# Altium schematic sheet P08 DDR3.SchDoc
size 420 x 297 mm
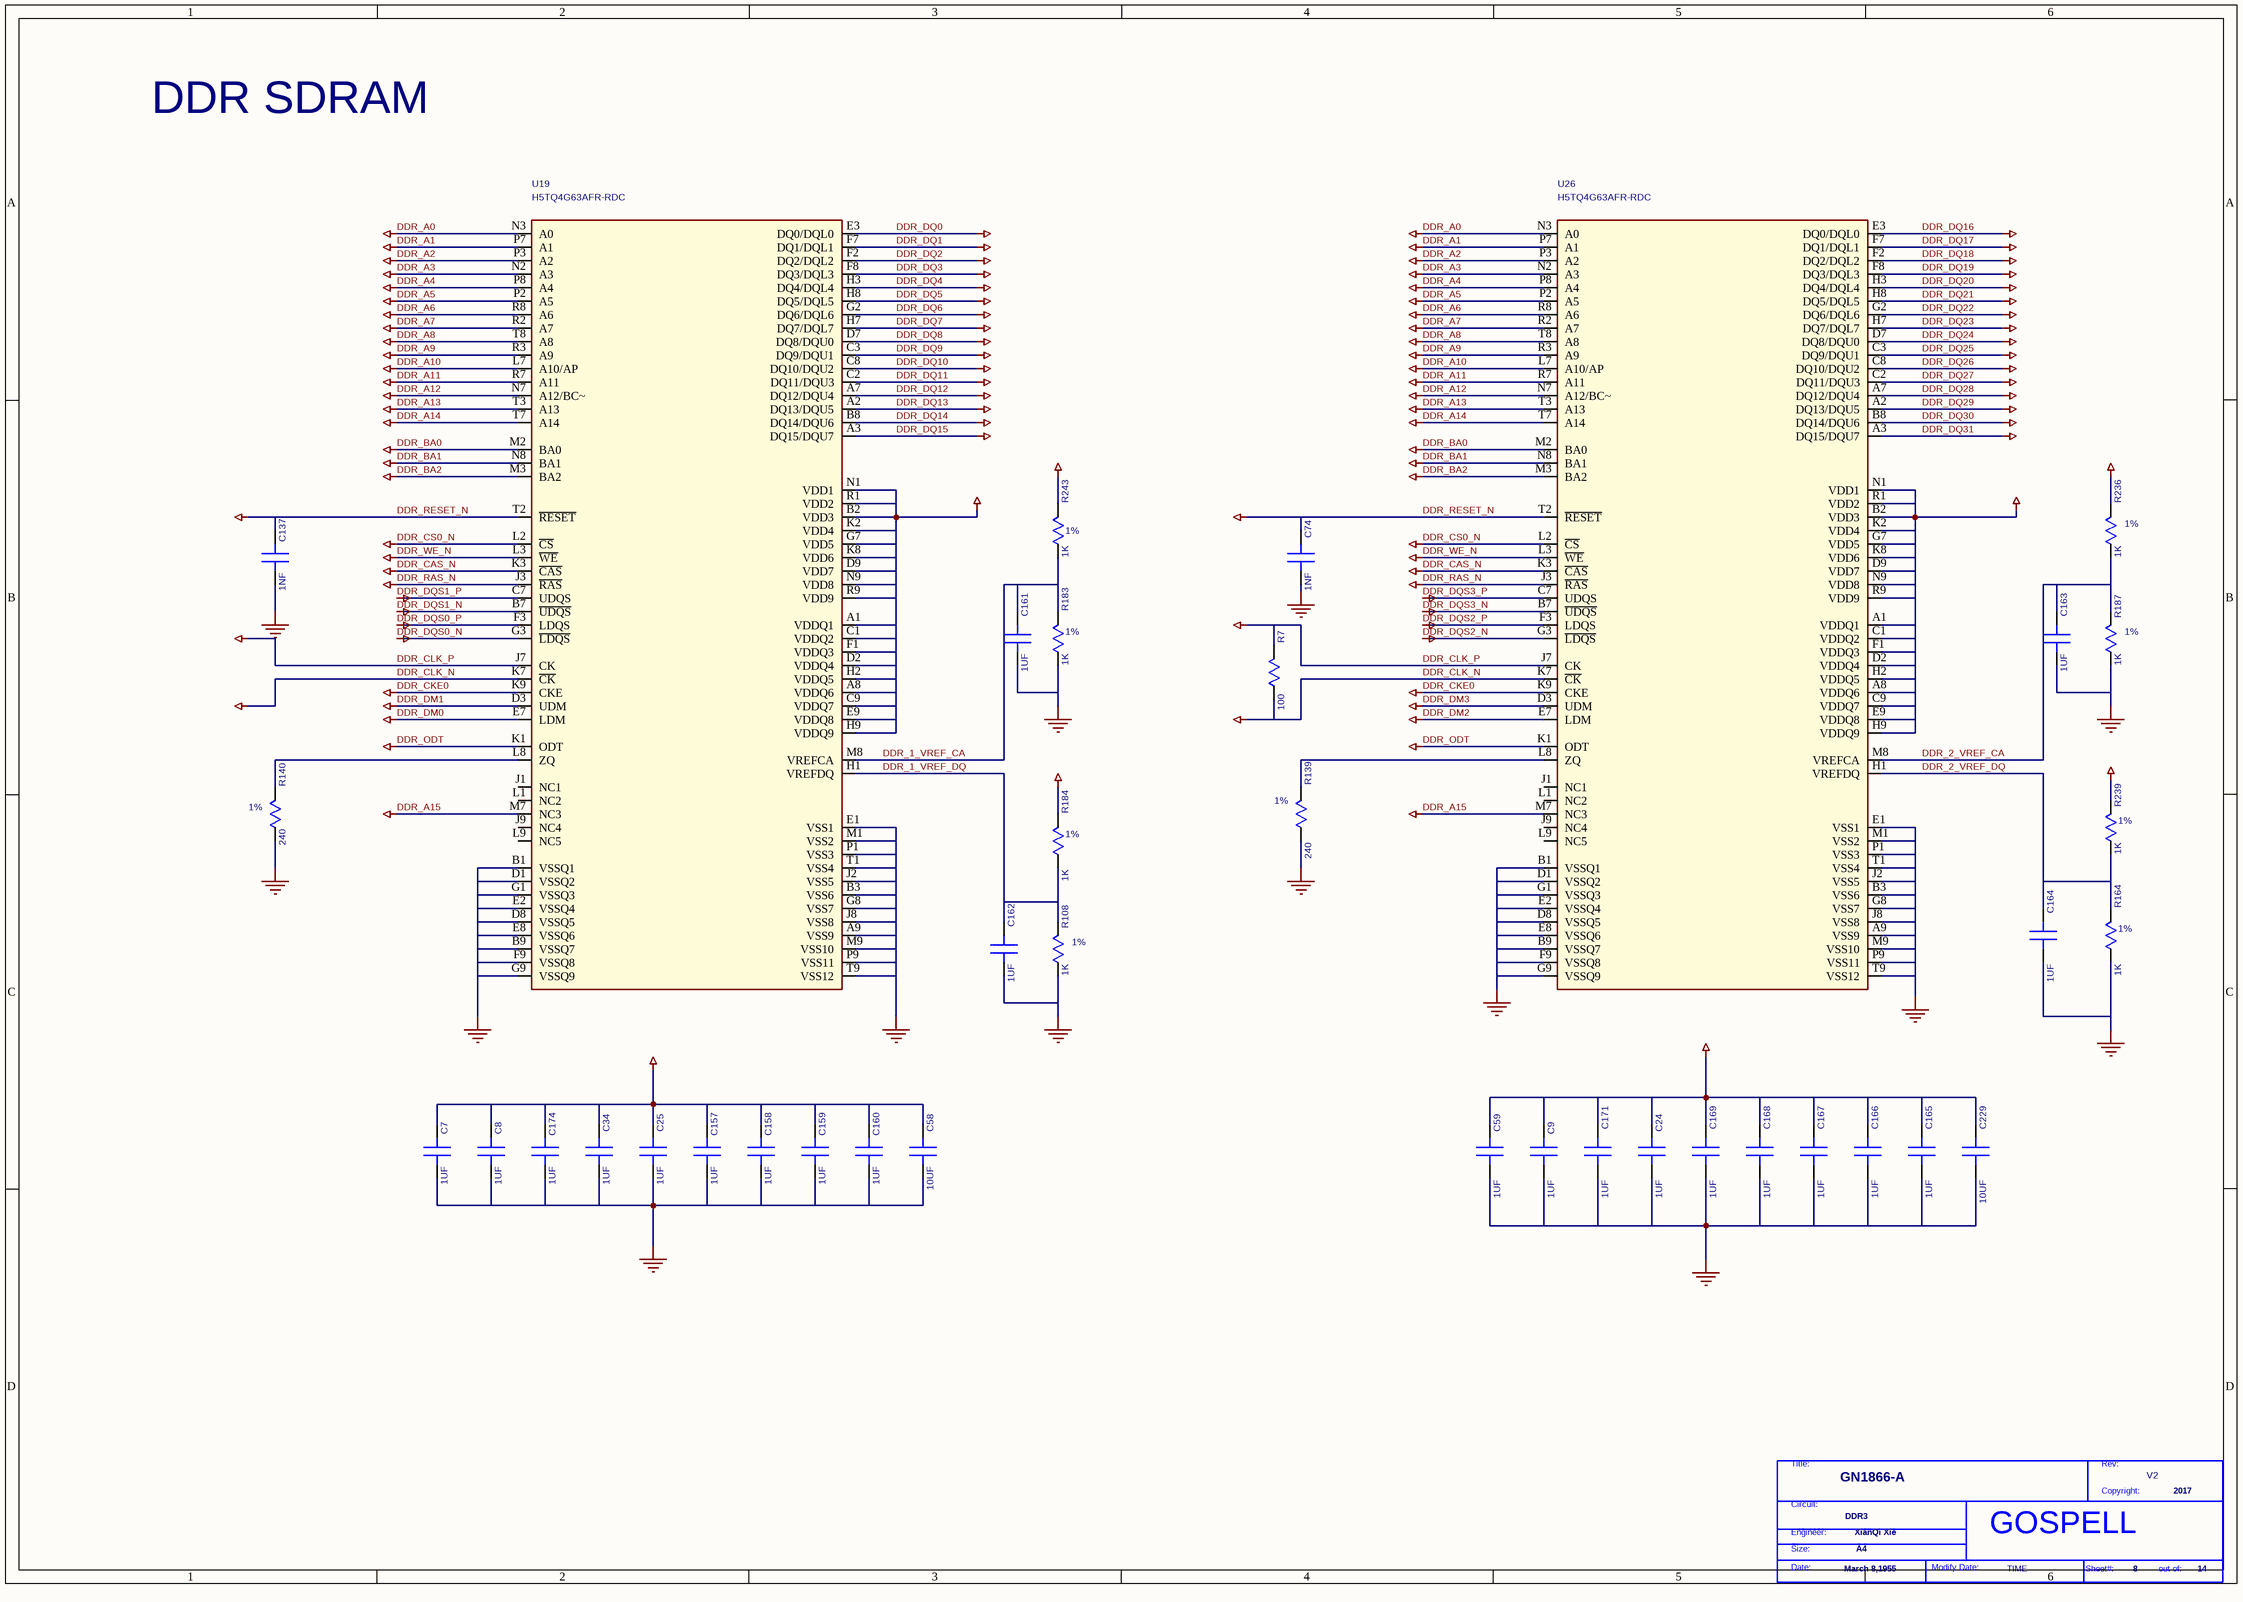
[diagram p0: P08 DDR3.SchDoc]

## Parts
*  Page Modify Date: TIME  Engineer: XianQi Xie  Copyright: 2017  Title: GN1866-A  RevCode: V2  Page Size: A4  Page Create Date: March 8,1955  Page Number: 8  Page Count: 14  Doc: DDR3  (hidden comment: GOSPELL)  (graphical)
C7  1UF  [SC0402]
C8  1UF  [SC0402]
C9  1UF  [SC0402]
C24  1UF  [SC0402]
C25  1UF  [SC0402]
C34  1UF  [SC0402]
C58  10UF  [SC0603]
C59  1UF  [SC0402]
C74  1NF  [SC0402]
C137  1NF  [SC0402]
C157  1UF  [SC0402]
C158  1UF  [SC0402]
C159  1UF  [SC0402]
C160  1UF  [SC0402]
C161  1UF  [SC0402]
C162  1UF  [SC0402]
C163  1UF  [SC0402]
C164  1UF  [SC0402]
C165  1UF  [SC0402]
C166  1UF  [SC0402]
C167  1UF  [SC0402]
C168  1UF  [SC0402]
C169  1UF  [SC0402]
C171  1UF  [SC0402]
C174  1UF  [SC0402]
C229  10UF  [SC0603]
R7  100  [SR0402]
R108  1K  [SR0402]
R139  240  [SR0402]
R140  240  [SR0402]
R164  1K  [SR0402]
R183  1K  [SR0402]
R184  1K  [SR0402]
R187  1K  [SR0402]
R236  1K  [SR0402]
R239  1K  [SR0402]
R243  1K  [SR0402]
U19  DEVICE: H5TQ4G63AFR-RDC  [BGA96-32-1609G]  (hidden comment: NT5CC256M16CP)
U26  DEVICE: H5TQ4G63AFR-RDC  [BGA96-32-1609G]  (hidden comment: NT5CC256M16CP)

## Nets
1V35/1V5: C7.1(A) C8.1(A) C9.1(A) C24.1(A) C25.1(A) C34.1(A) C58.1(A) C59.1(A) C157.1(A) C158.1(A) C159.1(A) C160.1(A) C165.1(A) C166.1(A) C167.1(A) C168.1(A) C169.1(A) C171.1(A) C174.1(A) C229.1(A) R184.2(B) R236.2(B) R239.2(B) R243.2(B) U19.A1(VDDQ1) U19.A8(VDDQ6) U19.B2(VDD3) U19.C1(VDDQ2) U19.C9(VDDQ7) U19.D2(VDDQ4) U19.D9(VDD7) U19.E9(VDDQ8) U19.F1(VDDQ3) U19.G7(VDD5) U19.H2(VDDQ5) U19.H9(VDDQ9) U19.K2(VDD4) U19.K8(VDD6) U19.N1(VDD1) U19.N9(VDD8) U19.R1(VDD2) U19.R9(VDD9) U26.A1(VDDQ1) U26.A8(VDDQ6) U26.B2(VDD3) U26.C1(VDDQ2) U26.C9(VDDQ7) U26.D2(VDDQ4) U26.D9(VDD7) U26.E9(VDDQ8) U26.F1(VDDQ3) U26.G7(VDD5) U26.H2(VDDQ5) U26.H9(VDDQ9) U26.K2(VDD4) U26.K8(VDD6) U26.N1(VDD1) U26.N9(VDD8) U26.R1(VDD2) U26.R9(VDD9)
DDR_A0: U19.N3(A0) U26.N3(A0)
DDR_A1: U19.P7(A1) U26.P7(A1)
DDR_A2: U19.P3(A2) U26.P3(A2)
DDR_A3: U19.N2(A3) U26.N2(A3)
DDR_A4: U19.P8(A4) U26.P8(A4)
DDR_A5: U19.P2(A5) U26.P2(A5)
DDR_A6: U19.R8(A6) U26.R8(A6)
DDR_A7: U19.R2(A7) U26.R2(A7)
DDR_A8: U19.T8(A8) U26.T8(A8)
DDR_A9: U19.R3(A9) U26.R3(A9)
DDR_A10: U19.L7(A10/AP) U26.L7(A10/AP)
DDR_A11: U19.R7(A11) U26.R7(A11)
DDR_A12: U19.N7(A12/BC~) U26.N7(A12/BC~)
DDR_A13: U19.T3(A13) U26.T3(A13)
DDR_A14: U19.T7(A14) U26.T7(A14)
DDR_A15: U19.M7(NC3) U26.M7(NC3)
DDR_BA0: U19.M2(BA0) U26.M2(BA0)
DDR_BA1: U19.N8(BA1) U26.N8(BA1)
DDR_BA2: U19.M3(BA2) U26.M3(BA2)
DDR_CAS_N: U19.K3(~{CAS}) U26.K3(~{CAS})
DDR_CKE0: U19.K9(CKE) U26.K9(CKE)
DDR_CLK_N: R7.1(A) U19.K7(~{CK}) U26.K7(~{CK})
DDR_CLK_P: R7.2(B) U19.J7(CK) U26.J7(CK)
DDR_CS0_N: U19.L2(~{CS}) U26.L2(~{CS})
DDR_DM0: U19.E7(LDM)
DDR_DM1: U19.D3(UDM)
DDR_DM2: U26.E7(LDM)
DDR_DM3: U26.D3(UDM)
DDR_DQ0: U19.E3(DQ0/DQL0)
DDR_DQ1: U19.F7(DQ1/DQL1)
DDR_DQ2: U19.F2(DQ2/DQL2)
DDR_DQ3: U19.F8(DQ3/DQL3)
DDR_DQ4: U19.H3(DQ4/DQL4)
DDR_DQ5: U19.H8(DQ5/DQL5)
DDR_DQ6: U19.G2(DQ6/DQL6)
DDR_DQ7: U19.H7(DQ7/DQL7)
DDR_DQ8: U19.D7(DQ8/DQU0)
DDR_DQ9: U19.C3(DQ9/DQU1)
DDR_DQ10: U19.C8(DQ10/DQU2)
DDR_DQ11: U19.C2(DQ11/DQU3)
DDR_DQ12: U19.A7(DQ12/DQU4)
DDR_DQ13: U19.A2(DQ13/DQU5)
DDR_DQ14: U19.B8(DQ14/DQU6)
DDR_DQ15: U19.A3(DQ15/DQU7)
DDR_DQ16: U26.E3(DQ0/DQL0)
DDR_DQ17: U26.F7(DQ1/DQL1)
DDR_DQ18: U26.F2(DQ2/DQL2)
DDR_DQ19: U26.F8(DQ3/DQL3)
DDR_DQ20: U26.H3(DQ4/DQL4)
DDR_DQ21: U26.H8(DQ5/DQL5)
DDR_DQ22: U26.G2(DQ6/DQL6)
DDR_DQ23: U26.H7(DQ7/DQL7)
DDR_DQ24: U26.D7(DQ8/DQU0)
DDR_DQ25: U26.C3(DQ9/DQU1)
DDR_DQ26: U26.C8(DQ10/DQU2)
DDR_DQ27: U26.C2(DQ11/DQU3)
DDR_DQ28: U26.A7(DQ12/DQU4)
DDR_DQ29: U26.A2(DQ13/DQU5)
DDR_DQ30: U26.B8(DQ14/DQU6)
DDR_DQ31: U26.A3(DQ15/DQU7)
DDR_DQS0_N: U19.G3(~{LDQS})
DDR_DQS0_P: U19.F3(LDQS)
DDR_DQS1_N: U19.B7(~{UDQS})
DDR_DQS1_P: U19.C7(UDQS)
DDR_DQS2_N: U26.G3(~{LDQS})
DDR_DQS2_P: U26.F3(LDQS)
DDR_DQS3_N: U26.B7(~{UDQS})
DDR_DQS3_P: U26.C7(UDQS)
DDR_ODT: U19.K1(ODT) U26.K1(ODT)
DDR_RAS_N: U19.J3(~{RAS}) U26.J3(~{RAS})
DDR_RESET_N: C74.1(A) C137.1(A) U19.T2(~{RESET}) U26.T2(~{RESET})
DDR_WE_N: U19.L3(~{WE}) U26.L3(~{WE})
GND: C7.2(B) C8.2(B) C9.2(B) C24.2(B) C25.2(B) C34.2(B) C58.2(B) C59.2(B) C74.2(B) C137.2(B) C157.2(B) C158.2(B) C159.2(B) C160.2(B) C161.2(B) C162.2(B) C163.2(B) C164.2(B) C165.2(B) C166.2(B) C167.2(B) C168.2(B) C169.2(B) C171.2(B) C174.2(B) C229.2(B) R108.1(A) R139.1(A) R140.1(A) R164.1(A) R183.1(A) R187.1(A) U19.A9(VSS9) U19.B1(VSSQ1) U19.B3(VSS6) U19.B9(VSSQ7) U19.D1(VSSQ2) U19.D8(VSSQ5) U19.E1(VSS1) U19.E2(VSSQ4) U19.E8(VSSQ6) U19.F9(VSSQ8) U19.G1(VSSQ3) U19.G8(VSS7) U19.G9(VSSQ9) U19.J2(VSS5) U19.J8(VSS8) U19.M1(VSS2) U19.M9(VSS10) U19.P1(VSS3) U19.P9(VSS11) U19.T1(VSS4) U19.T9(VSS12) U26.A9(VSS9) U26.B1(VSSQ1) U26.B3(VSS6) U26.B9(VSSQ7) U26.D1(VSSQ2) U26.D8(VSSQ5) U26.E1(VSS1) U26.E2(VSSQ4) U26.E8(VSSQ6) U26.F9(VSSQ8) U26.G1(VSSQ3) U26.G8(VSS7) U26.G9(VSSQ9) U26.J2(VSS5) U26.J8(VSS8) U26.M1(VSS2) U26.M9(VSS10) U26.P1(VSS3) U26.P9(VSS11) U26.T1(VSS4) U26.T9(VSS12)
DDR_1_VREF_CA: C161.1(A) R183.2(B) R243.1(A) U19.M8(VREFCA)
DDR_1_VREF_DQ: C162.1(A) R108.2(B) R184.1(A) U19.H1(VREFDQ)
DDR_2_VREF_CA: C163.1(A) R187.2(B) R236.1(A) U26.M8(VREFCA)
DDR_2_VREF_DQ: C164.1(A) R164.2(B) R239.1(A) U26.H1(VREFDQ)
NetR139_2: R139.2(B) U26.L8(ZQ)
NetR140_2: R140.2(B) U19.L8(ZQ)

Not connected (* = marked no-connect by the designer): U19 J1(NC1) J9(NC4) L1(NC2) L9(NC5); U26 J1(NC1) J9(NC4) L1(NC2) L9(NC5)

## Notes on the sheet
- DDR SDRAM
- (near R243) 1%
- (near R236) 1%
- (near R183) 1%
- (near R187) 1%
- (near R139) 1%
- (near R140) 1%
- (near R184) 1%
- (near R239) 1%
- (near R164) 1%
- (near R108) 1%
- (in symbol GOSPELL) Title:; Rev:; Copyright:; Circuit:; Engineer:; Size:; Date:; Modify Date:; Sheet#:; out of:

## Library data of the parts
C7-C9 C25 C59 C158 C160-C162 C165 C167 C169 C171 = C_0_Dup2: PARTS: 1; OriginalSymbolOrigin: (0,30); DEVICE: CV05X5R105K10AH; LEVEL: STD; PINSWAP: (A,B); GVALUE: C  10V  1uF +80%~-20%  X5R 0402; CODE: 8070612; %195%%232%%202%%246%: SMD陶瓷电容-10V-1000NF-+/-10%-X5R-0402-BT,TS16949; %182%%238%%182%%168%%185%%164%%215%%247%%181%%231%%209%%185%(V): 10; COMPONENT_HIGH_MAX: 0.55MM; %208%%161%%192%%224%%195%%251%%179%%198%: SMD陶瓷电容; PKG_TYPE: SC0402
C24 C34 C157 C159 C163 C164 C166 C168 = C_0_Dup2: PARTS: 1; OriginalSymbolOrigin: (0,30); DEVICE: CV05X5R105K10AH; LEVEL: STD; PINSWAP: (A,B); GVALUE: C  10V  1uF +80%~-20%  X5R 0402; %208%%161%%192%%224%%195%%251%%179%%198%: SMD陶瓷电容; COMPONENT_HIGH_MAX: 0.55MM; %182%%238%%182%%168%%185%%164%%215%%247%%181%%231%%209%%185%(V): 10; %195%%232%%202%%246%: SMD陶瓷电容-10V-1000NF-+/-10%-X5R-0402-BT,TS16949; CODE: 8070612; PKG_TYPE: SC0402
C58 C229 = C_0_Dup2: PARTS: 1; OriginalSymbolOrigin: (0,30); DEVICE: C1608X5R0J106MT0A0E; LEVEL: STD; PINSWAP: (A,B); CODE: 8070649; %195%%232%%202%%246%: SMD陶瓷电容-6.3V-10000NF-+/-20%-X5R-0603-BT,TS16949; %182%%238%%182%%168%%185%%164%%215%%247%%181%%231%%209%%185%(V): 6.3; COMPONENT_HIGH_MAX: 0.9MM; %208%%161%%192%%224%%195%%251%%179%%198%: SMD陶瓷电容; GVALUE: C  6.3V  10uF +80%~-20%  X5R 0603; PKG_TYPE: SC0603
C74 = C_0_Dup2: PARTS: 1; OriginalSymbolOrigin: (0,30); DEVICE: 04025C102KAT2A; LEVEL: STD; PINSWAP: (A,B); GVALUE: C  50V  1000pF +80%~-20%  X7R 0402; %208%%161%%192%%224%%195%%251%%179%%198%: SMD陶瓷电容; COMPONENT_HIGH_MAX: 0.56MM; %182%%238%%182%%168%%185%%164%%215%%247%%181%%231%%209%%185%(V): 50; %195%%232%%202%%246%: SMD陶瓷电容-50V-1NF-+/-10%-X7R-0402-BT; CODE: 8070531; PKG_TYPE: SC0402
C137 = C_0_Dup2: PARTS: 1; OriginalSymbolOrigin: (0,30); DEVICE: 04025C102KAT2A; LEVEL: STD; PINSWAP: (A,B); %208%%161%%192%%224%%195%%251%%179%%198%: SMD陶瓷电容; COMPONENT_HIGH_MAX: 0.56MM; %182%%238%%182%%168%%185%%164%%215%%247%%181%%231%%209%%185%(V): 50; %195%%232%%202%%246%: SMD陶瓷电容-50V-1NF-+/-10%-X7R-0402-BT; CODE: 8070531; GVALUE: C  50V  1000pF +80%~-20%  X7R 0402; PKG_TYPE: SC0402
C174 = C_0_Dup2: PARTS: 1; OriginalSymbolOrigin: (0,30); DEVICE: CV05X5R105K10AH; LEVEL: STD; PINSWAP: (A,B); %208%%161%%192%%224%%195%%251%%179%%198%: SMD陶瓷电容; COMPONENT_HIGH_MAX: 0.55MM; %182%%238%%182%%168%%185%%164%%215%%247%%181%%231%%209%%185%(V): 10; %195%%232%%202%%246%: SMD陶瓷电容-10V-1000NF-+/-10%-X5R-0402-BT,TS16949; CODE: 8070612; GVALUE: C  10V  1uF +80%~-20%  X5R 0402; PKG_TYPE: SC0402
R7 = R_0: PARTS: 1; OriginalSymbolOrigin: (10,20); PINSWAP: (A,B); DEVICE: RC0402JR_07100R; LEVEL: STD; %208%%161%%192%%224%%195%%251%%179%%198%: 片式厚膜电阻器; COMPONENT_HIGH_MAX: 0.4MM; %215%%232%%214%%181%%212%%202%%208%%237%%198%%171%%178%%238%: +/-5%; %182%%238%%182%%168%%185%%166%%194%%202%(W): 0.06; %195%%232%%202%%246%: 片式厚膜电阻器-0.0625W-100OHM-+/-5%-0402-BT; CODE: 7090807; GVALUE: R 1/16W 100±5% 0402; PKG_TYPE: SR0402
R108 R164 R183 R187 = R_0: PARTS: 1; OriginalSymbolOrigin: (10,20); PINSWAP: (A,B); DEVICE: RC0402FR_071KL; LEVEL: STD; CODE: 7091282; %195%%232%%202%%246%: 片式厚膜电阻器-0.0625W-1000OHM-+/-1%-0402-BT; %182%%238%%182%%168%%185%%166%%194%%202%(W): 0.06; %215%%232%%214%%181%%212%%202%%208%%237%%198%%171%%178%%238%: +/-1%; COMPONENT_HIGH_MAX: 0.4MM; %208%%161%%192%%224%%195%%251%%179%%198%: 片式厚膜电阻器; GVALUE: R 1/16W 1K±5% 0402; PKG_TYPE: SR0402
R139 R140 = R_0: PARTS: 1; OriginalSymbolOrigin: (10,20); PINSWAP: (A,B); DEVICE: RC0402FR_07240RL; LEVEL: STD; %208%%161%%192%%224%%195%%251%%179%%198%: 片式厚膜电阻器; COMPONENT_HIGH_MAX: 0.4MM; %215%%232%%214%%181%%212%%202%%208%%237%%198%%171%%178%%238%: +/- 1%; %182%%238%%182%%168%%185%%166%%194%%202%(W): 0.06; %195%%232%%202%%246%: 片式厚膜电阻器-0.0625W-240OHM-+/- 1%-0402-BT; CODE: 7091782; GVALUE: R 1/16W 240±1% 0402; PKG_TYPE: SR0402
R184 R236 R239 R243 = R_0: PARTS: 1; OriginalSymbolOrigin: (10,20); PINSWAP: (A,B); DEVICE: RC0402FR_071KL; LEVEL: STD; %208%%161%%192%%224%%195%%251%%179%%198%: 片式厚膜电阻器; COMPONENT_HIGH_MAX: 0.4MM; %215%%232%%214%%181%%212%%202%%208%%237%%198%%171%%178%%238%: +/-1%; %182%%238%%182%%168%%185%%166%%194%%202%(W): 0.06; %195%%232%%202%%246%: 片式厚膜电阻器-0.0625W-1000OHM-+/-1%-0402-BT; CODE: 7091282; GVALUE: R 1/16W 1K±5% 0402; PKG_TYPE: SR0402
U19 U26 = NT5CC256M16CP_2: PARTS: 1; OriginalSymbolOrigin: (10,580); LEVEL: STD; CODE: 19V101DDR85; %195%%232%%202%%246%: DDR3 DRAM-4GBIT-933MHZ-16BIT-1.5V-FBGA96(无铅); COMPONENT_HIGH_MAX: 1.2MM; %208%%161%%192%%224%%195%%251%%179%%198%: DDR3 DRAM; GVALUE: NT5CB256M16CP-EK; FORWARD_PCB: 1; PKG_TYPE: BGA96-32-1609G
* = GOSPELL: Cage Code: 2017